# Altium project SPECCY2010.PrjPCB
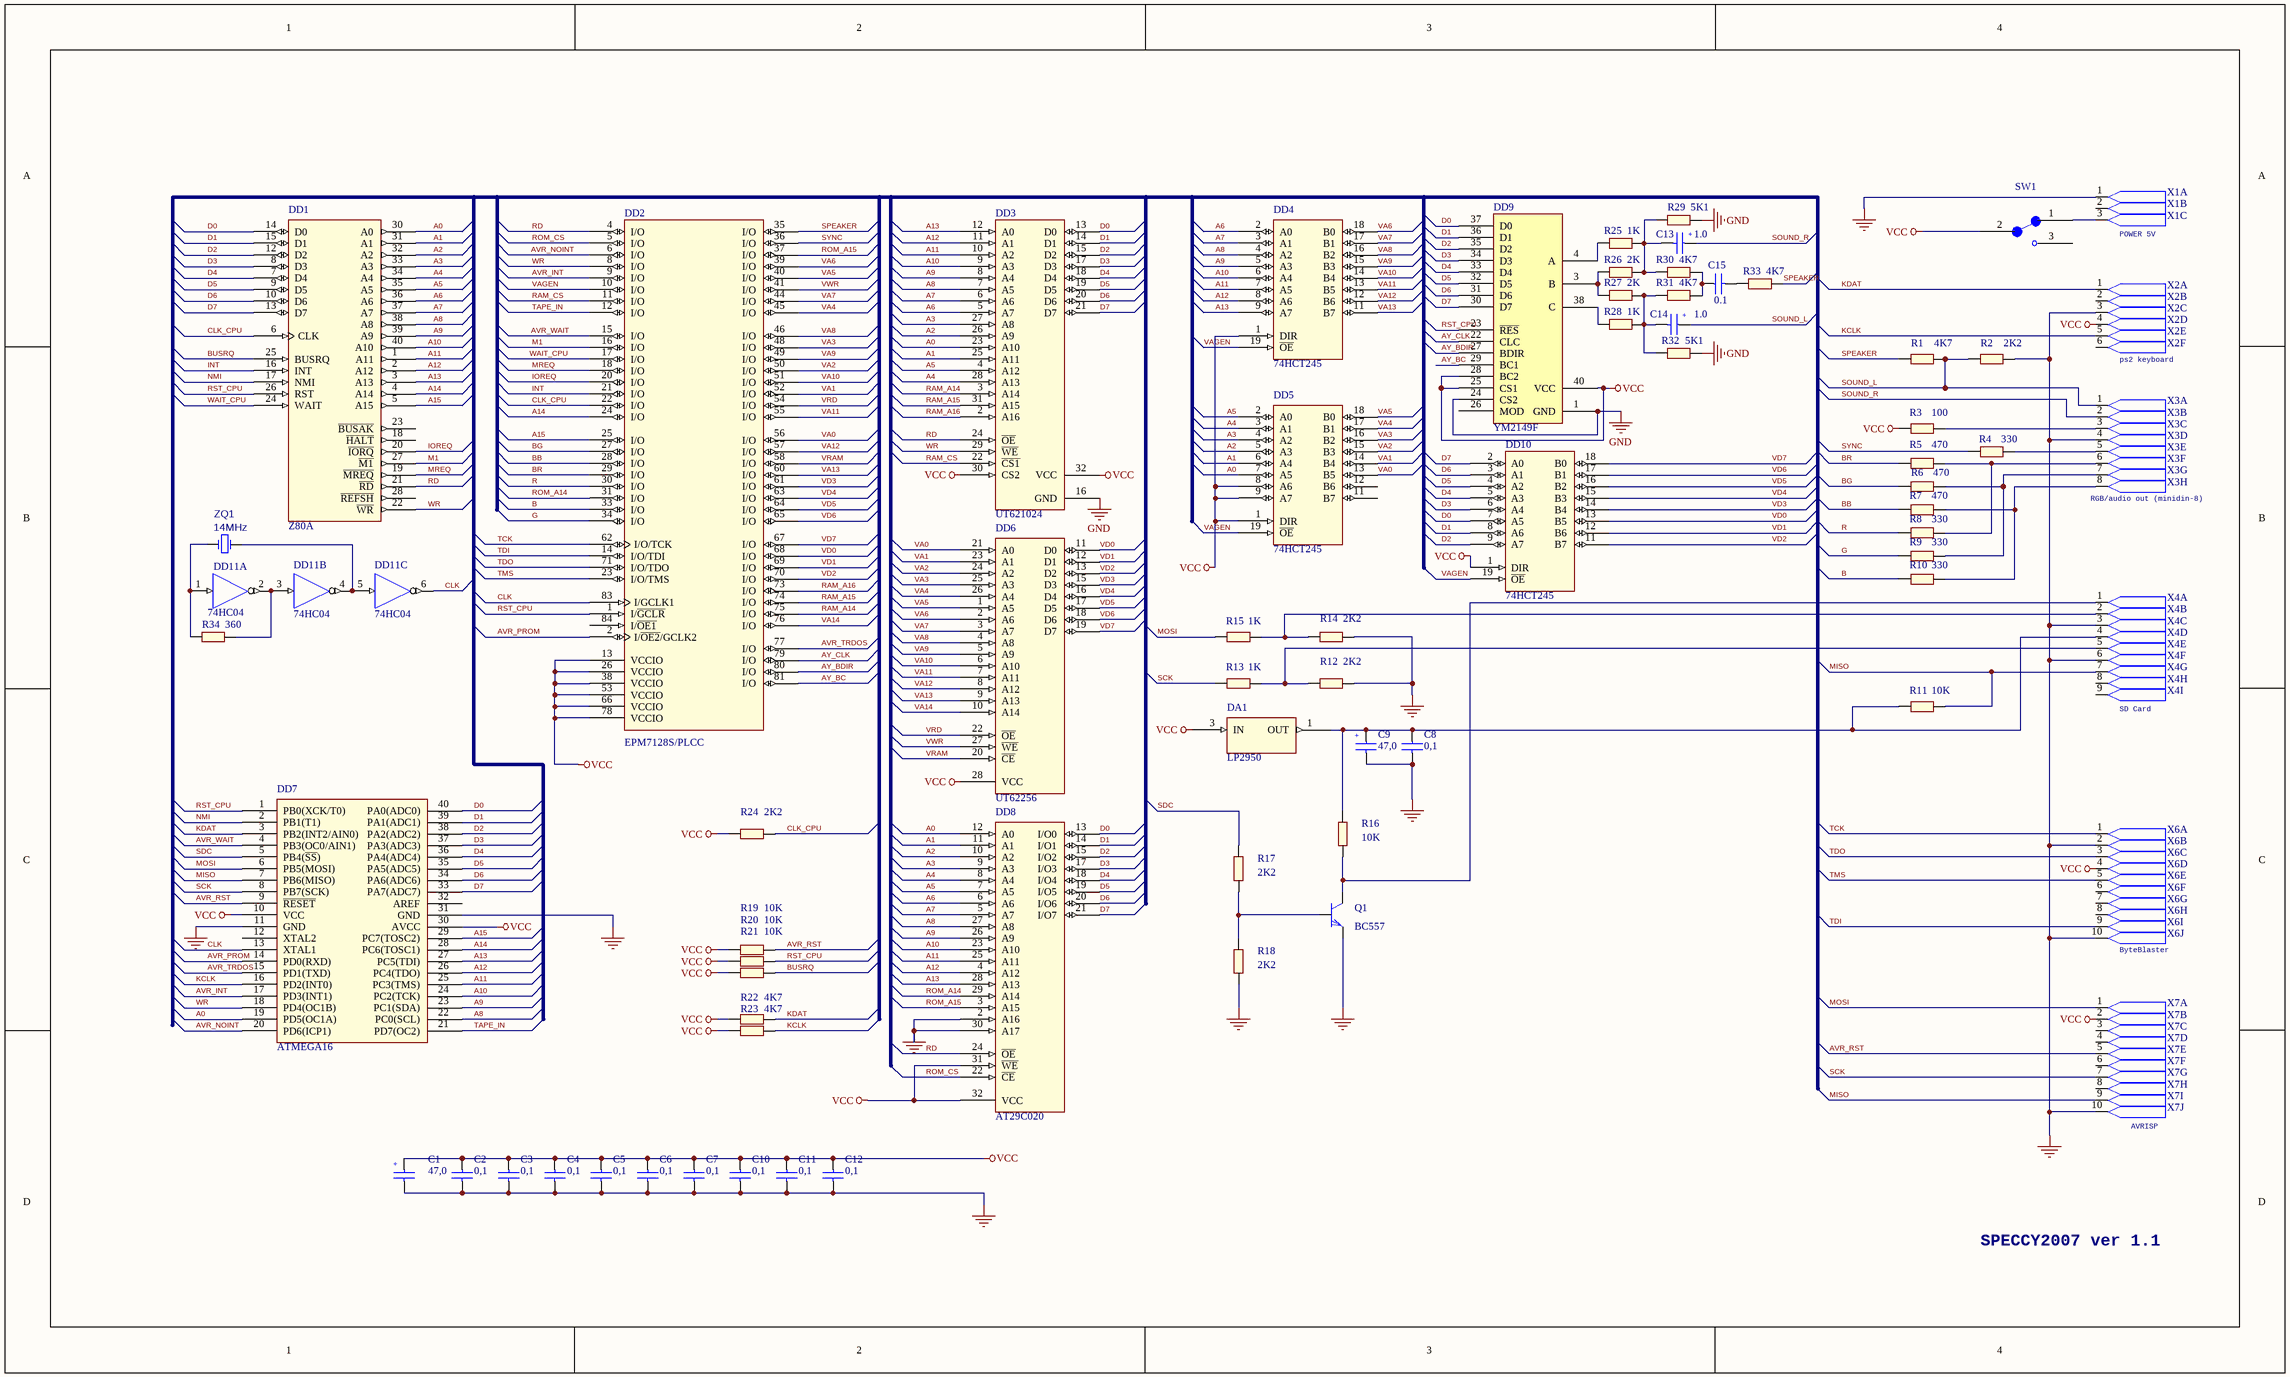
[diagram p0: SPECCY2010.SchDoc]
1 sheet, 70 parts. Net scope: global (net labels, ports and power ports of the same name join across sheets).
Board file: SPECCY2010.PcbDoc

## Sheet SPECCY2010.SchDoc
size 500 x 299 mm; PageSetup: Record=PageOptions|CenterHorizontal=True|CenterVertical=True|PrintScale=0.74|XCorrection=1.00|YCorrection=1.00|PrintKind=0|BorderSize=5000000|LeftOffset=0|BottomOffset=0|Orientation=2|PaperLength=2970|PaperWidth=2100|Scale=100|PaperSource=7|PrintQuality=600|MediaType=1|DitherType=2|PaperKind=A4|PrintScaleMode=1

### Parts
C1  47,0  [CAPPOL_2.54]
C2  0,1  [CAP_5.08-7.8x3.2]
C3  0,1  [CAP_5.08-7.8x3.2]
C4  0,1  [CAP_5.08-7.8x3.2]
C5  0,1  [CAP_5.08-7.8x3.2]
C6  0,1  [CAP_5.08-7.8x3.2]
C7  0,1  [CAP_5.08-7.8x3.2]
C8  0,1  [CAP_5.08-7.8x3.2]
C9  47,0  [CAPPOL_2.54]
C10  0,1  [CAP_5.08-7.8x3.2]
C11  0,1  [CAP_5.08-7.8x3.2]
C12  0,1  [CAP_5.08-7.8x3.2]
C13  1.0  [CAPPOL_2.54]
C14  1.0  [CAPPOL_2.54]
C15  0.1  [CAP_5.08-7.8x3.2]
DA1  LP2950  [TO92]
DD1  Z80A  [DIP-40]
DD2  EPM7128S/PLCC  [PLCC84-Socket+AlteraMAX700S]
DD3  UT621024  [DIP-32/D41.2]
DD4  74HCT245  [DIP-20]
DD5  74HCT245  [DIP-20]
DD6  UT62256  [DIP-28W]
DD7  ATMEGA16  [DIP-40]
DD8  AT29C020  [DIP-32/D41.2]
DD9  YM2149F  [DIP-40]
DD10  74HCT245  [DIP-20]
DD11  74HC04  [DIP-14]  (parts A,B,C of 6)
Q1  BC557  [TO92]
R1  4K7  [RES_10.16]
R2  2K2  [RES_10.16]
R3  100  [RES_10.16]
R4  330  [RES_10.16]
R5  470  [RES_10.16]
R6  470  [RES_10.16]
R7  470  [RES_10.16]
R8  330  [RES_10.16]
R9  330  [RES_10.16]
R10  330  [RES_10.16]
R11  10K  [RES_10.16]
R12  2K2  [RES_10.16]
R13  1K  [RES_10.16]
R14  2K2  [RES_10.16]
R15  1K  [RES_10.16]
R16  10K  [RES_10.16]
R17  2K2  [RES_10.16]
R18  2K2  [RES_10.16]
R19  10K  [RES_10.16]
R20  10K  [RES_10.16]
R21  10K  [RES_10.16]
R22  4K7  [RES_10.16]
R23  4K7  [RES_10.16]
R24  2K2  [RES_10.16]
R25  1K  [RES_10.16]
R26  2K  [RES_10.16]
R27  2K  [RES_10.16]
R28  1K  [RES_10.16]
R29  5K1  [RES_10.16]
R30  4K7  [RES_10.16]
R31  4K7  [RES_10.16]
R32  5K1  [RES_10.16]
R33  4K7  [RES_10.16]
R34  360  [RES_10.16]
SW1  SW_T_SPDT  [SW_T_SPDT]  (value not drawn)
X1  X3  [CONN JACK PWR]  (value not drawn)  (parts A,B,C of 3)
X2  X6  [Mini-DIN6]  (value not drawn)  (parts A,B,C,D,E,F of 6)
X3  X8  [Mini-DIN8]  (value not drawn)  (parts A,B,C,D,E,F,G,H of 8)
X4  X9  [SD Card socket]  (value not drawn)  (parts A,B,C,D,E,F,G,H,I of 9)
X6  X10  [Double row pin strip 5 way]  (value not drawn)  (parts A,B,C,D,E,F,G,H,I,J of 10)
X7  X10  [Double row pin strip 5 way]  (value not drawn)  (parts A,B,C,D,E,F,G,H,I,J of 10)
ZQ1  14MHz  [QUARTZ]

### Nets
GND: C1.MINUS C2.2 C3.2 C4.2 C5.2 C6.2 C7.2 C8.2 C9.MINUS C10.2 C11.2 C12.2 DA1.2(GND) DD1.29(GND) DD2.7(GND) DD2.19(GND) DD2.32(GND) DD2.42(GND) DD2.47(GND) DD2.59(GND) DD2.72(GND) DD2.82(GND) DD3.16(GND) DD4.10(GND) DD5.10(GND) DD6.14(GND) DD7.11(GND) DD7.31(GND) DD8.2(A16) DD8.16(GND) DD8.30(A17) DD9.1(GND) DD9.24(CS2) DD10.10(GND) DD11.7(GND) Q1.1(e) R2.2 R12.2 R14.2 R18.1 R29.2 R32.2 X1.1(CON) X2.3(CON) X3.4(CON) X4.3(CON) X4.6(CON) X6.2(CON) X6.10(CON) X7.10(CON)
VCC: C1.PLUS C2.1 C3.1 C4.1 C5.1 C6.1 C7.1 C10.1 C11.1 C12.1 DA1.3(IN) DD1.11(VCC) DD2.3(VCC) DD2.13(VCCIO) DD2.26(VCCIO) DD2.38(VCCIO) DD2.43(VCC) DD2.53(VCCIO) DD2.66(VCCIO) DD2.78(VCCIO) DD3.30(CS2) DD3.32(VCC) DD4.1(DIR) DD4.20(VCC) DD5.1(DIR) DD5.8(A6) DD5.9(A7) DD5.20(VCC) DD6.28(VCC) DD7.10(VCC) DD7.30(AVCC) DD8.31(~{WE}) DD8.32(VCC) DD9.25(CS1) DD9.28(BC2) DD9.40(VCC) DD10.1(DIR) DD10.20(VCC) DD11.14(VCC) R3.1 R19.1 R20.1 R21.1 R22.1 R23.1 R24.1 SW1.2(COMMON) X2.4(CON) X6.4(CON) X7.2(CON)
A0: DD1.30(A0) DD3.23(A10) DD5.7(A5) DD7.19(PD5(OC1A)) DD8.12(A0)
A1: DD1.31(A1) DD3.25(A11) DD5.6(A4) DD8.11(A1)
A2: DD1.32(A2) DD3.26(A9) DD5.5(A3) DD8.10(A2)
A3: DD1.33(A3) DD3.27(A8) DD5.4(A2) DD8.9(A3)
A4: DD1.34(A4) DD3.28(A13) DD5.3(A1) DD8.8(A4)
A5: DD1.35(A5) DD3.4(A12) DD5.2(A0) DD8.7(A5)
A6: DD1.36(A6) DD3.5(A7) DD4.2(A0) DD8.6(A6)
A7: DD1.37(A7) DD3.6(A6) DD4.3(A1) DD8.5(A7)
A8: DD1.38(A8) DD3.7(A5) DD4.4(A2) DD7.22(PC0(SCL)) DD8.27(A8)
A9: DD1.39(A9) DD3.8(A4) DD4.5(A3) DD7.23(PC1(SDA)) DD8.26(A9)
A10: DD1.40(A10) DD3.9(A3) DD4.6(A4) DD7.24(PC2(TCK)) DD8.23(A10)
A11: DD1.1(A11) DD3.10(A2) DD4.7(A5) DD7.25(PC3(TMS)) DD8.25(A11)
A12: DD1.2(A12) DD3.11(A1) DD4.8(A6) DD7.26(PC4(TDO)) DD8.4(A12)
A13: DD1.3(A13) DD3.12(A0) DD4.9(A7) DD7.27(PC5(TDI)) DD8.28(A13)
A14: DD1.4(A14) DD2.24(I/O) DD7.28(PC6(TOSC1))
A15: DD1.5(A15) DD2.25(I/O) DD7.29(PC7(TOSC2))
AVR_INT: DD2.9(I/O) DD7.17(PD3(INT1))
AVR_NOINT: DD2.6(I/O) DD7.20(PD6(ICP1))
AVR_PROM: DD2.2(I/~{OE2}/GCLK2) DD7.14(PD0(RXD))
AVR_RST: DD7.9(~{RESET}) R19.2 X7.5(CON)
AVR_TRDOS: DD2.77(I/O) DD7.15(PD1(TXD))
AVR_WAIT: DD2.15(I/O) DD7.4(PB3(OC0/AIN1))
AY_BC: DD2.81(I/O) DD9.29(BC1)
AY_BDIR: DD2.80(I/O) DD9.27(BDIR)
AY_CLK: DD2.79(I/O) DD9.22(CLC)
B: DD2.33(I/O) R10.1
BB: DD2.28(I/O) R7.1
BG: DD2.27(I/O) R6.1
BR: DD2.29(I/O) R5.1
BUSRQ: DD1.25(BUSRQ) R21.2
CLK: DD2.83(I/GCLK1) DD7.13(XTAL1) DD11.6(Y)
CLK_CPU: DD1.6(CLK) DD2.22(I/O) R24.2
D0: DD1.14(D0) DD3.13(D0) DD7.40(PA0(ADC0)) DD8.13(I/O0) DD9.37(D0) DD10.7(A5)
D1: DD1.15(D1) DD3.14(D1) DD7.39(PA1(ADC1)) DD8.14(I/O1) DD9.36(D1) DD10.8(A6)
D2: DD1.12(D2) DD3.15(D2) DD7.38(PA2(ADC2)) DD8.15(I/O2) DD9.35(D2) DD10.9(A7)
D3: DD1.8(D3) DD3.17(D3) DD7.37(PA3(ADC3)) DD8.17(I/O3) DD9.34(D3) DD10.6(A4)
D4: DD1.7(D4) DD3.18(D4) DD7.36(PA4(ADC4)) DD8.18(I/O4) DD9.33(D4) DD10.5(A3)
D5: DD1.9(D5) DD3.19(D5) DD7.35(PA5(ADC5)) DD8.19(I/O5) DD9.32(D5) DD10.4(A2)
D6: DD1.10(D6) DD3.20(D6) DD7.34(PA6(ADC6)) DD8.20(I/O6) DD9.31(D6) DD10.3(A1)
D7: DD1.13(D7) DD3.21(D7) DD7.33(PA7(ADC7)) DD8.21(I/O7) DD9.30(D7) DD10.2(A0)
G: DD2.34(I/O) R9.1
INT: DD1.16(INT) DD2.21(I/O)
IOREQ: DD1.20(~{IORQ}) DD2.20(I/O)
KCLK: DD7.16(PD2(INT0)) R23.2 X2.5(CON)
KDAT: DD7.3(PB2(INT2/AIN0)) R22.2 X2.1(CON)
M1: DD1.27(~{M1}) DD2.16(I/O)
MISO: DD7.7(PB6(MISO)) R11.2 X4.7(CON) X7.9(CON)
MOSI: DD7.6(PB5(MOSI)) R15.1 X7.1(CON)
MREQ: DD1.19(~{MREQ}) DD2.18(I/O)
NMI: DD1.17(NMI) DD7.2(PB1(T1))
R: DD2.30(I/O) R8.1
RAM_A14: DD2.75(I/O) DD3.3(A14)
RAM_A15: DD2.74(I/O) DD3.31(A15)
RAM_A16: DD2.73(I/O) DD3.2(A16)
RAM_CS: DD2.11(I/O) DD3.22(~{CS1})
RD: DD1.21(~{RD}) DD2.4(I/O) DD3.24(~{OE}) DD8.24(~{OE})
ROM_A14: DD2.31(I/O) DD8.29(A14)
ROM_A15: DD2.37(I/O) DD8.3(A15)
ROM_CS: DD2.5(I/O) DD8.22(~{CE})
RST_CPU: DD1.26(RST) DD2.1(I/~{GCLR}) DD7.1(PB0(XCK/T0)) DD9.23(~{RES}) R20.2
SCK: DD7.8(PB7(SCK)) R13.1 X7.7(CON)
SDC: DD7.5(PB4(~{SS})) R17.2
SOUND_L: C14.PLUS R1.2 R2.1 X3.1(CON)
SOUND_R: C13.PLUS X3.2(CON)
SPEAKER: DD2.35(I/O) R1.1 R33.2
SYNC: DD2.36(I/O) R4.1
TAPE_IN: DD2.12(I/O) DD7.21(PD7(OC2))
TCK: DD2.62(I/O/TCK) X6.1(CON)
TDI: DD2.14(I/O/TDI) X6.9(CON)
TDO: DD2.71(I/O/TDO) X6.3(CON)
TMS: DD2.23(I/O/TMS) X6.5(CON)
VA0: DD2.56(I/O) DD5.13(B5) DD6.21(A0)
VA1: DD2.52(I/O) DD5.14(B4) DD6.23(A1)
VA2: DD2.50(I/O) DD5.15(B3) DD6.24(A2)
VA3: DD2.48(I/O) DD5.16(B2) DD6.25(A3)
VA4: DD2.45(I/O) DD5.17(B1) DD6.26(A4)
VA5: DD2.40(I/O) DD5.18(B0) DD6.1(A5)
VA6: DD2.39(I/O) DD4.18(B0) DD6.2(A6)
VA7: DD2.44(I/O) DD4.17(B1) DD6.3(A7)
VA8: DD2.46(I/O) DD4.16(B2) DD6.4(A8)
VA9: DD2.49(I/O) DD4.15(B3) DD6.5(A9)
VA10: DD2.51(I/O) DD4.14(B4) DD6.6(A10)
VA11: DD2.55(I/O) DD4.13(B5) DD6.7(A11)
VA12: DD2.57(I/O) DD4.12(B6) DD6.8(A12)
VA13: DD2.60(I/O) DD4.11(B7) DD6.9(A13)
VA14: DD2.76(I/O) DD6.10(A14)
VAGEN: DD2.10(I/O) DD4.19(~{OE}) DD5.19(~{OE}) DD10.19(~{OE})
VD0: DD2.68(I/O) DD6.11(D0) DD10.13(B5)
VD1: DD2.69(I/O) DD6.12(D1) DD10.12(B6)
VD2: DD2.70(I/O) DD6.13(D2) DD10.11(B7)
VD3: DD2.61(I/O) DD6.15(D3) DD10.14(B4)
VD4: DD2.63(I/O) DD6.16(D4) DD10.15(B3)
VD5: DD2.64(I/O) DD6.17(D5) DD10.16(B2)
VD6: DD2.65(I/O) DD6.18(D6) DD10.17(B1)
VD7: DD2.67(I/O) DD6.19(D7) DD10.18(B0)
VRAM: DD2.58(I/O) DD6.20(~{CE})
VRD: DD2.54(I/O) DD6.22(~{OE})
VWR: DD2.41(I/O) DD6.27(~{WE})
WAIT_CPU: DD1.24(WAIT) DD2.17(I/O)
WR: DD1.22(~{WR}) DD2.8(I/O) DD3.29(~{WE}) DD7.18(PD4(OC1B))
NetC8_1: C8.1 C9.PLUS DA1.1(OUT) R11.1 R16.2 X4.4(CON)
NetC13_MINUS: C13.MINUS R25.2 R26.2 R29.1 R30.1
NetC14_MINUS: C14.MINUS R27.2 R28.2 R31.1 R32.1
NetC15_1: C15.1 R30.2 R31.2
NetC15_2: C15.2 R33.1
NetDD9_3: DD9.3(B) R26.1 R27.1
NetDD9_4: DD9.4(A) R25.1
NetDD9_38: DD9.38(C) R28.1
NetDD11_1: DD11.1(A) R34.1 ZQ1.1
NetDD11_2: DD11.2(Y) DD11.3(A) R34.2
NetDD11_4: DD11.4(Y) DD11.5(A) ZQ1.2
NetQ1_2: Q1.2(b) R17.1 R18.2
NetQ1_3: Q1.3(c) R16.1 X4.1(CON)
NetR3_2: R3.2 X3.3(CON)
NetR4_2: R4.2 X3.5(CON)
NetR5_2: R5.2 R8.2 X3.6(CON)
NetR6_2: R6.2 R9.2 X3.7(CON)
NetR7_2: R7.2 R10.2 X3.8(CON)
NetR12_1: R12.1 R13.2 X4.5(CON)
NetR14_1: R14.1 R15.2 X4.2(CON)
NetSW1_1: SW1.1(NC) X1.3(CON)

Not connected (* = marked no-connect by the designer): DD1 18(~{HALT}) 23(~{BUSAK}) 28(~{REFSH}); DD2 84(I/~{OE1}); DD5 11(B7) 12(B6); DD7 12(XTAL2) 32(AREF); DD9 26(MOD); SW1 3(NO); X1 2(CON); X2 2(CON) 6(CON); X4 8(CON) 9(CON); X6 6(CON) 7(CON) 8(CON); X7 3(CON) 4(CON) 6(CON) 8(CON)

### Notes on the sheet
- (near X1) POWER 5V
- (near X2) ps2 keyboard
- (near X3) RGB/audio out (minidin-8)
- (near X4) SD Card
- (near X6) ByteBlaster
- (near X7) AVRISP
- SPECCY2007 ver 1.1
- (in symbol C POL) +

### Library data of the parts
C1 C9 C13 C14 = C POL
C2-C8 C10-C12 C15 = C
DD6 = CY62256_Syd's
DD11 = 74HC04: Hex Inverter; Published: 17-Jul-2002; LatestRevisionDate: 06-Jun-2005; LatestRevisionNote: Stylized 3D Model Added; DatasheetVersion: 1989; PackageVersion: 1997; PackageReference: 646-06; Publisher: Altium Limited; PackageDescription: DIP; 14 Leads; Row Spacing 7.62 mm; Pitch 2.54 mm; ComponentLink1Description: Manufacturer Link; ComponentLink1URL: http://www.onsemi.com/site/products/parametrics/0,4446,247,00.html
Q1 = TRANS NPN
R1-R34 = R
X4 = X9: SD Card socket
ZQ1 = QUARTZ: Value: {Value}